# EasyEDA schematic SCH_ESP_weather_Cube_2022-04-09.json
TITLE: 0.96oled气象站; REV: 1.0; Date: 2020-07-02; Sheet: 1/1; Drawn By: hbk444; Company: Your Company
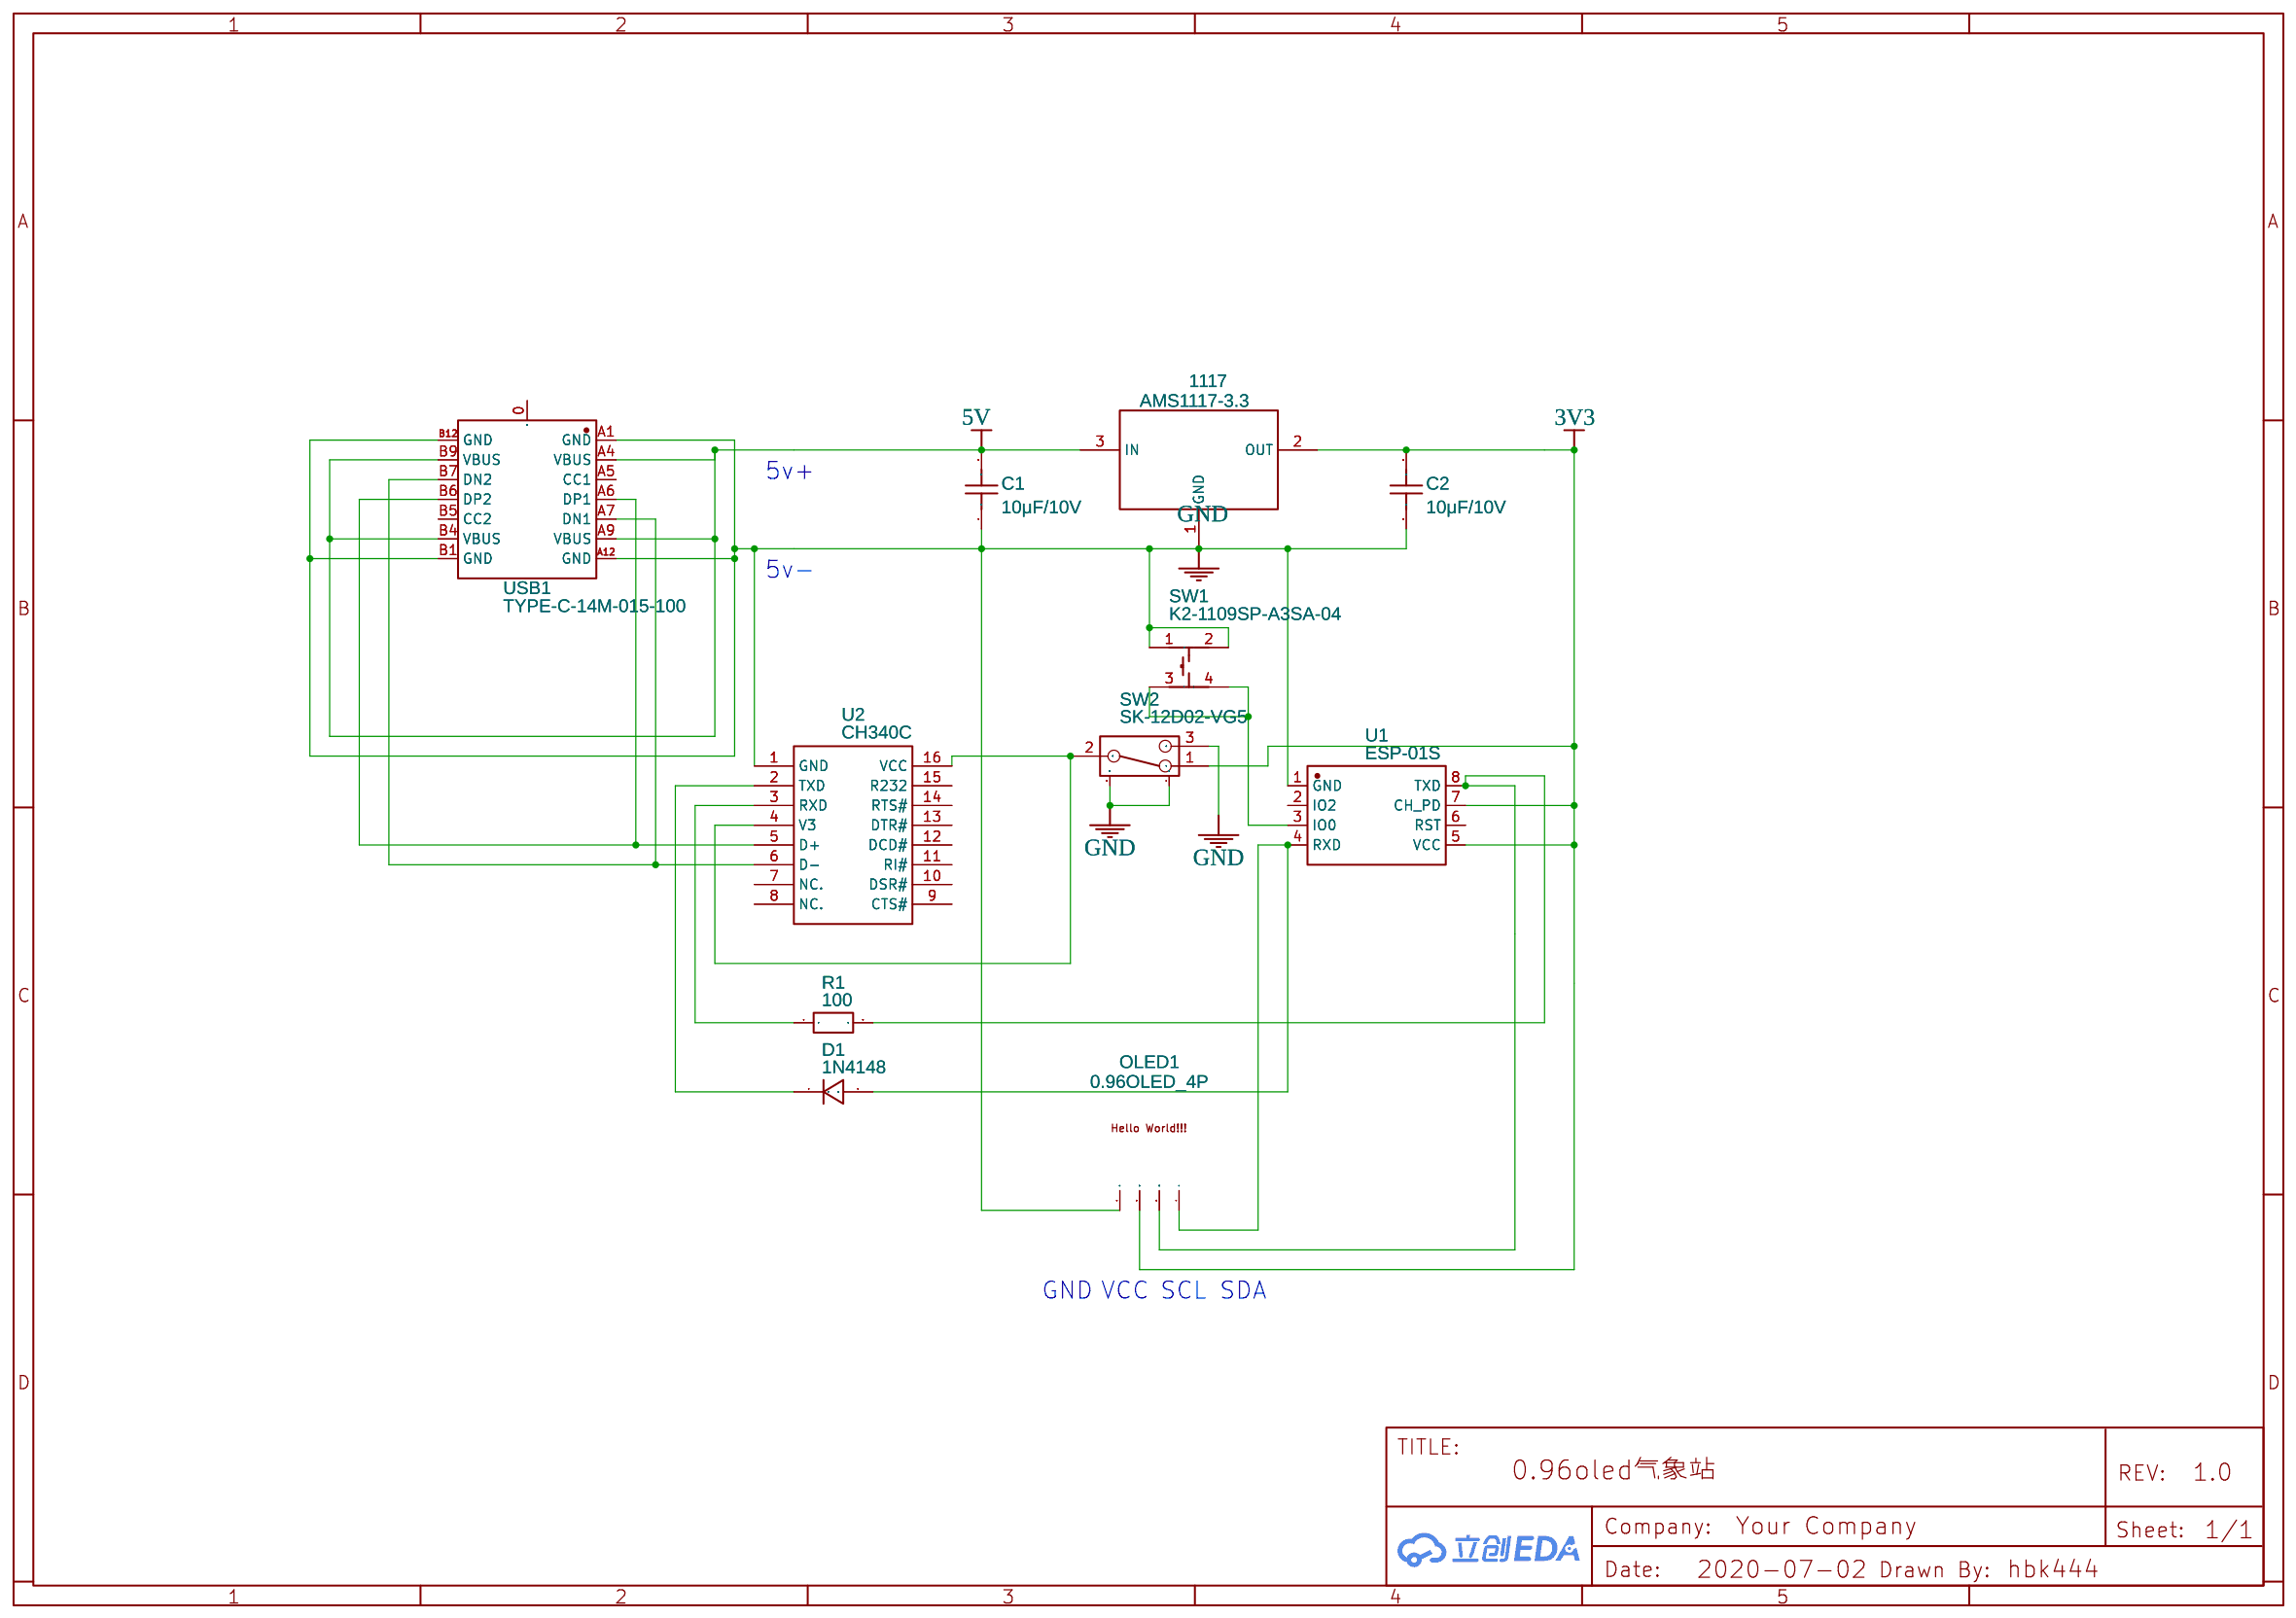
[diagram p0: schematic sheet]

## Parts
1117  AMS1117-3.3  [SOT223_JX]
C1  10μF/10V  [0603_C_JX]
C2  10μF/10V  [0603_C_JX]
D1  1N4148  [SOD-123FL_L2.7-W1.8-LS3.8-RD]
OLED1  0.96OLED_4P  [0.96OLED_4P]
R1  100  [R0603]
SW1  K2-1109SP-A3SA-04  [KEY-SMD_4P-L4.5-W4.5-P3.00-LS6.5-TL]
SW2  SK-12D02-VG5  [SW-TH_SK-12D02VG3]
U1  ESP-01S  [WIFIM-TH_ESP-01S]
U2  CH340C  [SOP-16_L10.0-W3.9-P1.27-LS6.0-BL]
USB1  TYPE-C-14M-015-100  [USB-C-TH_14P-L8.9-W10.0-P0.95]

## Library data of the parts
1117 = -: Contributor: jixin002
C1 C2 = Capacitor: Supplier: LCSC
D1 = 1N4148: Supplier: LCSC; Supplier Part: C13769; Manufacturer: STMicroelectronics; Contributor: LCSC
OLED1 = 0.96OLED_4P: Supplier: LCSC; Contributor: LCEDA_Lib
R1 = R_0603_EU: Contributor: LCEDA_Lib
SW1 = K2-1109SP-A3SA-04: Supplier: LCSC; Supplier Part: C516447; Manufacturer: Korean Hroparts Elec; Contributor: LCSC
SW2 = SK-12D02-VG5: Supplier: LCSC; Supplier Part: C136722; Manufacturer: Rectangular Connectors - Contacts; Contributor: LCSC
U1 = ESP-01S: Supplier: LCSC; Manufacturer: Ai-Thinker; Supplier Part: C111009
U2 = CH340C: Supplier: LCSC; Manufacturer: WCH; Supplier Part: C84681; JLCPCB Part Class: Extended Part
USB1 = TYPE-C-14M-015-100: Supplier: LCSC; Supplier Part: C2798183; Manufacturer: USAKRO(美韩); Contributor: LCSC; JLCPCB Part Class: Extended Part

## Nets
3V3: 1117.2(OUT) C2.2 OLED1.2 SW2.1 U1.5(VCC) U1.7(CH_PD)
5V: 1117.3(IN) C1.2 USB1.A4(VBUS) USB1.A9(VBUS) USB1.B4(VBUS) USB1.B9(VBUS)
GND: 1117.1(GND) C1.1 C2.1 OLED1.1 SW1.1 SW1.2 SW2.3 SW2.4 SW2.5 U1.1(GND) U2.1(GND) USB1.A1(GND) USB1.A12(GND) USB1.B1(GND) USB1.B12(GND)
Net-(D1-1): D1.1 U2.2(TXD)
Net-(D1-2): D1.2 OLED1.4 U1.4(RXD)
Net-(OLED1-3): OLED1.3 R1.2 U1.8(TXD)
Net-(R1-1): R1.1 U2.3(RXD)
Net-(SW1-3): SW1.3 SW1.4 U1.3(IO0)
Net-(SW2-2): SW2.2 U2.4(V3) U2.16(VCC)
Net-(U2-5): U2.5(D+) USB1.A6(DP1) USB1.B6(DP2)
Net-(U2-6): U2.6(D-) USB1.A7(DN1) USB1.B7(DN2)

Not connected (* = marked no-connect by the designer): U1 2(IO2) 6(RST); U2 7(NC.) 8(NC.) 9(CTS#) 10(DSR#) 11(RI#) 12(DCD#) 13(DTR#) 14(RTS#) 15(R232); USB1 0 A5(CC1) B5(CC2)

## Notes on the sheet
- 5v+
- 5v-
- GND
- VCC
- SCL
- SDA
